# EAGLE design RN42_breakout (EAGLE 7.5.0)
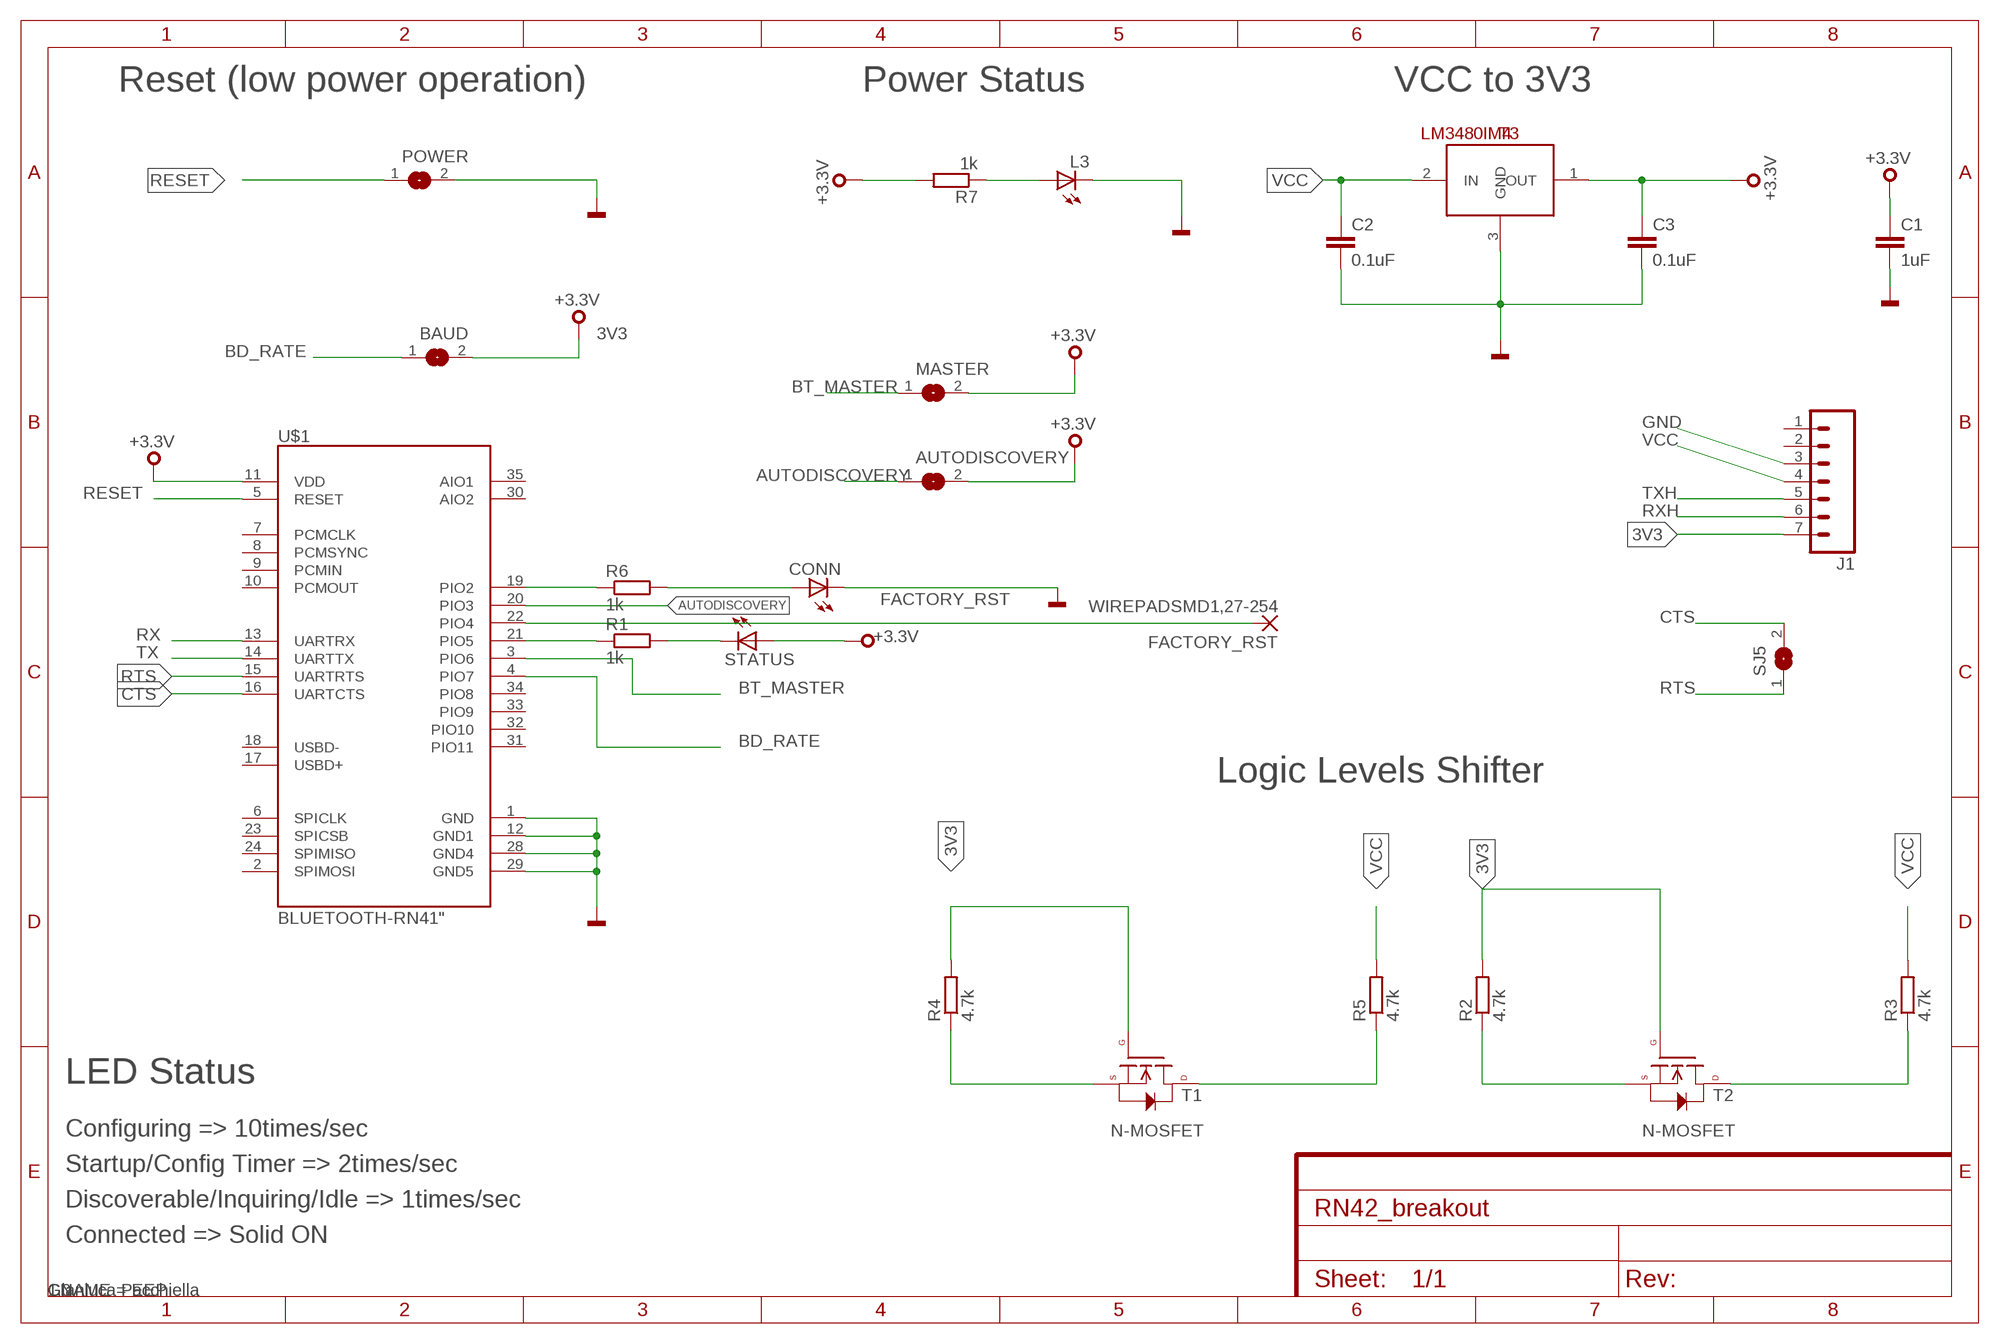
[diagram p0: schematic, sheet 1]
FRAME1 (FRAME-A4L): CNAME: EEP; CREVISION: 1.0; DESIGNER: Gianluca Pacchiella

## Parts
AUTODISCOVERY  SJ  [SJ]
BAUD  SJ  [SJ]
C1  1uF  C-EUC0603  [C0603]
C2  0.1uF  CAP0603-CAP  [0603-CAP]
C3  0.1uF  CAP0603-CAP  [0603-CAP]
CONN  LEDCHIPLED_0603  [CHIPLED_0603]
FACTORY_RST  WIREPADSMD1,27-254  [SMD1,27-2,54]
J1  M07  [1X07]
L3  LEDCHIPLED_0603  [CHIPLED_0603]
MASTER  SJ  [SJ]
POWER  SJ  [SJ]
R1  1k  R-EU_R0603  [R0603]
R2  4.7k  R-EU_R0603  [R0603]
R3  4.7k  R-EU_R0603  [R0603]
R4  4.7k  R-EU_R0603  [R0603]
R5  4.7k  R-EU_R0603  [R0603]
R6  1k  R-EU_R0603  [R0603]
R7  1k  R-EU_R0603  [R0603]
SJ5  SJ  [SJ]
STATUS  LEDCHIPLED_0603  [CHIPLED_0603]
T1  N-MOSFET  N-CHANNEL-MOSFET-BSS138  [SOT23-3]
T2  N-MOSFET  N-CHANNEL-MOSFET-BSS138  [SOT23-3]
T3  LM3480IM4  [SOT23-3]
U$1  BLUETOOTH-RN41"  [RN41]

## Nets
3V3: AUTODISCOVERY.2 BAUD.2 C1.1 C3.1 J1.7 MASTER.2 R2.2 R4.2 R7.2 STATUS.A T1.1(G) T2.1(G) T3.1(OUT) U$1.11(VDD) ; supply symbol labelled +3.3V
AUTODISCOVERY: AUTODISCOVERY.1 U$1.20(PIO3)
BD_RATE: BAUD.1 U$1.4(PIO7)
BT_MASTER: MASTER.1 U$1.3(PIO6)
CTS: SJ5.2 U$1.16(UARTCTS)
FACTORY_RST: FACTORY_RST.1(P) U$1.22(PIO4)
GND: C1.2 C2.2 C3.2 CONN.C J1.3 L3.C POWER.2 T3.3(GND) U$1.1(GND) U$1.12(GND1) U$1.28(GND4) U$1.29(GND5)
N$1: R1.2 STATUS.C
N$2: R1.1 U$1.21(PIO5)
N$3: CONN.A R6.2
N$4: L3.A R7.1
RESET: POWER.1 U$1.5(RESET)
RTS: SJ5.1 U$1.15(UARTRTS)
RX: R2.1 T2.2(S) U$1.13(UARTRX)
RXH: J1.6 R3.1 T2.3(D)
STATUS: R6.1 U$1.19(PIO2)
TX: R4.1 T1.2(S) U$1.14(UARTTX)
TXH: J1.5 R5.1 T1.3(D)
VCC: C2.1 J1.4 R3.2 R5.2 T3.2(IN)
Unconnected: J1.1 J1.2 U$1.2(SPIMOSI) U$1.6(SPICLK) U$1.7(PCMCLK) U$1.8(PCMSYNC) U$1.9(PCMIN) U$1.10(PCMOUT) U$1.17(USBD+) U$1.18(USBD-) U$1.23(SPICSB) U$1.24(SPIMISO) U$1.30(AIO2) U$1.31(PIO11) U$1.32(PIO10) U$1.33(PIO9) U$1.34(PIO8) U$1.35(AIO1)

## Notes on the sheet
- Reset (low power operation) | Power Status | VCC to 3V3
- Logic Levels Shifter
- LED Status
- Configuring => 10times/sec
- Startup/Config Timer => 2times/sec
- Discoverable/Inquiring/Idle => 1times/sec
- Connected => Solid ON

## Library data of the parts
AUTODISCOVERY BAUD MASTER POWER SJ5 = jumper:SJ: SMD solder JUMPER
C1 = rcl:C-EU: CAPACITOR, European symbol
C2 C3 = SparkFun-Passives:CAP: Capacitor Standard 0603 ceramic capacitor, and 0.1" leaded capacitor.
CONN L3 STATUS = led:LED: LED OSRAM: - CHIPLED LG R971, LG N971, LY N971, LG Q971, LY Q971, LO R971, LY R971 LH N974, LH R974 LS Q976, LO Q976, LY Q976 LO Q996 - Hyper CHIPLED LW Q18S LB Q993, LB Q99A, LB R99A - SideLED LS A670, LO A670, LY A670, LG A670, LP A670 LB A673, LV A673, LT A673, LW A673 LH A674 LY A675 LS A676, LA A676, LO A676, LY A676, LW A676 LS A679, LY A679, LG A679 - Hyper Micro SIDELED® LS Y876, LA Y876, LO Y876, LY Y876 LT Y87S - SmartLED LW L88C, LW L88S LB L89C, LB L89S, LG L890 LS L89K, LO L89K, LY L89K LS L896, LA L896, LO L896, LY L896 - TOPLED LS T670, LO T670, LY T670, LG T670, LP T670 LSG T670, LSP T670, LSY T670, LOP T670, LYG T670 LG T671, LOG T671, LSG T671 LB T673, LV T673, LT T673, LW T673 LH T674 LS T676, LA T676, LO T676, LY T676, LB T676, LH T676, LSB T676, LW T676 LB T67C, LV T67C, LT T67C, LS T67K, LO T67K, LY T67K, LW E67C LS E67B, LA E67B, LO E67B, LY E67B, LB E67C, LV E67C, LT E67C LW T67C LS T679, LY T679, LG T679 LS T770, LO T770, LY T770, LG T770, LP T770 LB T773, LV T773, LT T773, LW T773 LH T774 LS E675, LA E675, LY E675, LS T675 LS T776, LA T776, LO T776, LY T776, LB T776 LHGB T686 LT T68C, LB T68C - Hyper Mini TOPLED® LB M676 - Mini TOPLED Santana® LG M470 LS M47K, LO M47K, LY M47K Source: http://www.osram.convergy.de LUXEON: - LUMILED® LXK2-PW12-R00, LXK2-PW12-S00, LXK2-PW14-U00, LXK2-PW14-V00 LXK2-PM12-R00, LXK2-PM12-S00, LXK2-PM14-U00 LXK2-PE12-Q00, LXK2-PE12-R00, LXK2-PE12-S00, LXK2-PE14-T00, LXK2-PE14-U00 LXK2-PB12-K00, LXK2-PB12-L00, LXK2-PB12-M00, LXK2-PB14-N00, LXK2-PB14-P00, LXK2-PB14-Q00 LXK2-PR12-L00, LXK2-PR12-M00, LXK2-PR14-Q00, LXK2-PR14-R00 LXK2-PD12-Q00, LXK2-PD12-R00, LXK2-PD12-S00 LXK2-PH12-R00, LXK2-PH12-S00 LXK2-PL12-P00, LXK2-PL12-Q00, LXK2-PL12-R00 Source: www.luxeon.com KINGBRIGHT: KA-3528ASYC Source: www.kingbright.com
FACTORY_RST = wirepad:WIREPAD: Wire PAD connect wire on PCB
J1 = SparkFun-Connectors:M07: Header 7 Standard 7-pin 0.1" header. Use with straight break away headers (SKU : PRT-00116), right angle break away headers (PRT-00553), swiss pins (PRT-00743), machine pins (PRT-00117), and female headers (PRT-00115). NOTES ON THE VARIANTS LOCK and LOCK_LONGPADS... This footprint was designed to help hold the alignment of a through-hole component (i.e. 7-pin header) while soldering it into place. You may notice that each hole has been shifted either up or down by 0.005 of an inch from it's more standard position (which is usually a perfectly straight line). This slight alteration caused the pins (the squares in the middle) to touch the edges of the holes. Because they are alternating, it causes a "brace" to hold the header in place. 0.005 has proven to be the perfect amount of "off-center" position when using our standard breakaway headers. Although looks a little odd when you look at the bare footprint, once you have a header in there, the alteration is very hard to notice. Also, if you push a header all the way into place, it is covered up entirely on the bottom side. This idea of altering the position of holes to aid alignment will be further integrated into the Sparkfun Library for other footprints. It can help hold any component with 3 or more connection pins.
R1-R7 = rcl:R-EU_: RESISTOR, European symbol
T1 = GeekAmmo:N-CHANNEL-MOSFET: N-Channel MOSFET Mode Field Effect Transistor; DATASHEET: http://www.onsemi.com/pub/Collateral/NTR4501N-D.PDF; DIGIKEY: BSS138TR-ND; ELEMENT14: 2323154; URL: http://au.element14.com/fairchild-semiconductor/bss138/mosfet-n-ch-50v-220ma-sot-23/dp/2323154
T2 = GeekAmmo:N-CHANNEL-MOSFET: N-Channel MOSFET Mode Field Effect Transistor; DATASHEET: http://www.fairchildsemi.com/ds/BS/BSS138.pdf; DIGIKEY: BSS138TR-ND; ELEMENT14: 2323154; URL: http://au.element14.com/fairchild-semiconductor/bss138/mosfet-n-ch-50v-220ma-sot-23/dp/2323154
T3 = SparkFun-PowerIC:LM3480IM4: Small package linear regulator
U$1 = SparkFun:BLUETOOTH-RN41

## Board
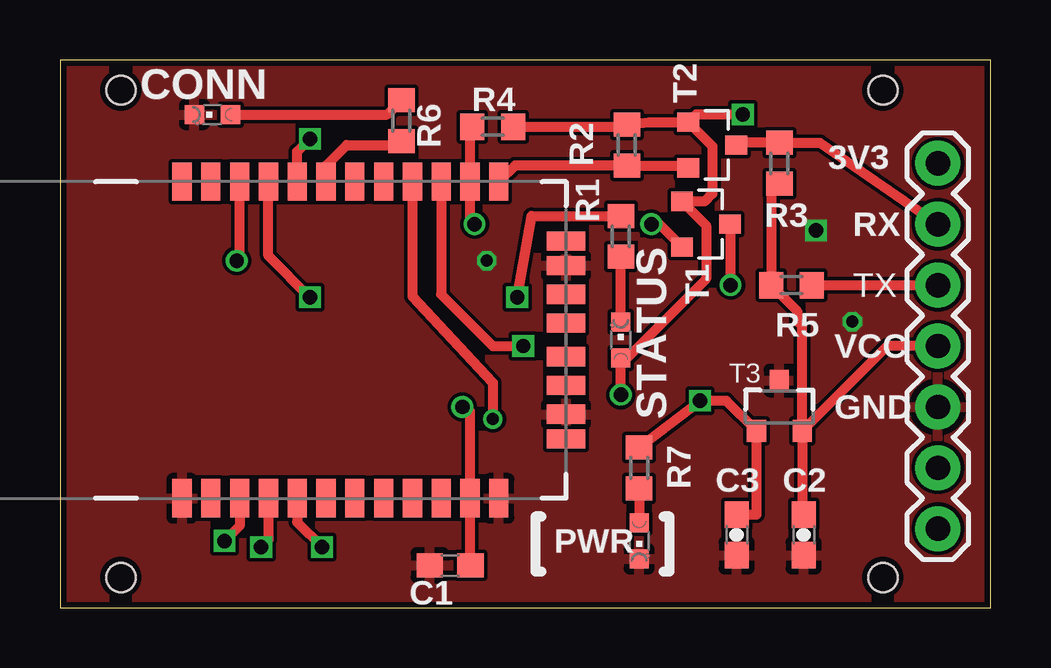
[diagram p1: board, top side]
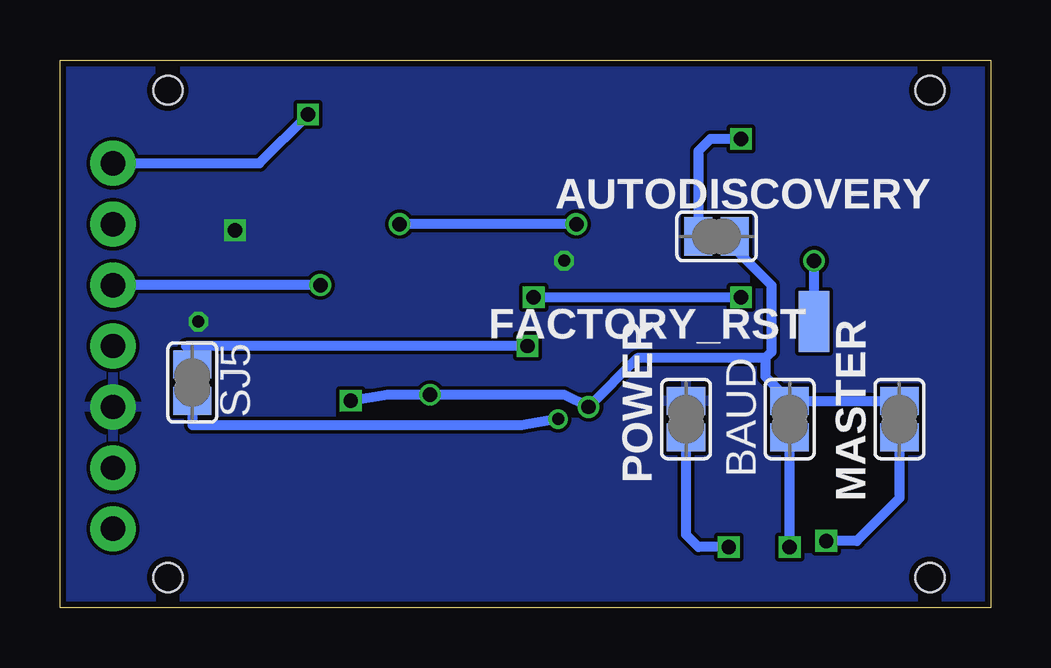
[diagram p2: board, bottom side, seen from below]

Size 38.79 x 22.85 mm. Coordinates in mm from the lower left corner, seen from the top.
Outline: 0,0 38.79,0 38.79,22.85 0,22.85 0,0
Copper layers (1*16): Top 0.035mm / dielectric 1.5mm / Bottom 0.035mm
Design rules "SeeedStudio_2layer_DRU_no_angle_20140221": minimum track width 6mil, minimum drill 12mil, track to track 6mil, track to pad 6mil, pad to pad 6mil, via to via 6mil, smd to smd 0mil, copper to edge 10mil, drill to drill 10mil, minimum pad ring 10mil, minimum via ring 6mil, stop-mask expansion 2mil, vias tented up to drill 100mil, thermal gap 10mil
Holes 1.2 mm at 2.54,21.59 2.54,1.27 34.29,21.59 34.29,1.27

### Footprints (pad centres in the part's own frame; a part is rotated, then mirrored left to right if it is on the bottom)
SJ = smd 1.168 x 1.6: 1 -0.762,0; 2 0.762,0
C0603 = smd 1.1 x 1: 1 -0.85,0; 2 0.85,0
0603-CAP = smd 1.1 x 1: 1 -0.85,0; 2 0.85,0
CHIPLED_0603 = smd 0.8 x 0.8: A 0,-0.75; C 0,0.75
SMD1,27-2,54 = smd 1.27 x 2.54: 1 0,0
1X07 = drill 1.016 pad 1.88: 1 0,0; 2 2.54,0; 3 5.08,0; 4 7.62,0; 5 10.16,0; 6 12.7,0; 7 15.24,0
R0603 = smd 1 x 1.1: 1 -0.85,0; 2 0.85,0
SOT23-3 = smd 0.8 x 0.9: 1 -0.95,-1; 2 0.95,-1; 3 0,1
SOT23-3' = smd 0.8 x 0.9: 1 -0.95,-1; 2 0.95,-1; 3 0,1.1
RN41 = smd 0.8 x 1.6: 1 -6.6,-6.6; 2 -5.4,-6.6; 3 -4.2,-6.6; 4 -3,-6.6; 5 -1.8,-6.6; 6 -0.6,-6.6; 7 0.6,-6.6; 8 1.8,-6.6; 9 3,-6.6; 10 4.2,-6.6; 11 5.4,-6.6; 12 6.6,-6.6; 13 6.6,6.6; 14 5.4,6.6; 15 4.2,6.6; 16 3,6.6; 17 1.8,6.6; 18 0.6,6.6; 19 -0.6,6.6; 20 -1.8,6.6; 21 -3,6.6; 22 -4.2,6.6; 23 -5.4,6.6; 24 -6.6,6.6 | smd 1.6 x 0.8: 28 9.4,3.1; 29 9.4,-3.1; 30 9.4,-4.122; 31 9.4,-1.9; 32 9.4,-0.7; 33 9.4,0.7; 34 9.4,1.9; 35 9.4,4.122

### Placement (x,y rotation side)
AUTODISCOVERY  11.43,15.49 0 bottom
BAUD  8.38,7.87 90 bottom
C1  16.26,1.78 180 top
C2  30.99,3.05 270 top
C3  28.19,3.05 270 top
CONN  6.35,20.57 90 top
FACTORY_RST  7.37,11.94 0 bottom
J1  36.58,3.3 90 top
L3  24.13,2.79 180 top
MASTER  3.81,7.87 90 bottom
POWER  12.7,7.87 90 bottom
R1  23.37,15.49 270 top
R2  23.62,19.3 90 top
R3  29.97,18.54 270 top
R4  18.03,20.07 0 top
R5  30.48,13.46 180 top
R6  14.22,20.32 90 top
R7  24.13,5.84 90 top
SJ5  33.27,9.4 270 bottom
STATUS  23.37,11.18 0 top
T1  26.92,16 270 top
T2  27.18,19.3 270 top
T3  LM3480IM4  [SOT23-3']  29.97,8.38 0 top
U$1  11.68,11.18 0 top

### Tracks (layer width: path | path; a pad name or v marks a point on that pad's centre or on a via)
3V3  (via drill 0.6)
  Top 0.406: v16.76,8.38 17.08,8.19 U$1.11 17.08,1.78 C1.1 | v23.37,8.89 STATUS.A 23.63,10.43 26.92,13.72 26.92,15.95 T1.1 26.86,16.95 27.18,17.27 27.18,19.25 T2.1 | 26.69,8.65 v26.67,8.64 | v26.67,8.64 27.77,8.64 T3.1 29.02,3.9 C3.1 | T2.1 24.54,20.25 R2.2 23.03,20.07 R4.2 | R7.2 v26.67,8.64 | v28.45,20.57 26.5,20.57 T2.1
  Bottom 0.406: v26.67,8.64 25.15,8.89 v23.37,8.89 17.78,8.89 v16.76,8.38 14.73,10.41 9.4,10.41 | 36.58,18.29 J1.7 30.48,18.54 v28.45,20.57 | 9.4,10.41 9.14,10.67 9.14,13.46 10.67,14.99 AUTODISCOVERY.2 | 9.4,10.41 9.4,9.65 BAUD.2 MASTER.2
AUTODISCOVERY  (via drill 0.6)
  Top 0.406: U$1.20 9.88,19.03 v10.41,19.56
  Bottom 0.406: v10.41,19.56 11.68,19.56 12.19,19.05 AUTODISCOVERY.1
BD_RATE  (via drill 0.6)
  Top 0.406: U$1.4 8.68,2.84 v8.38,2.54
  Bottom 0.406: v8.38,2.54 BAUD.1
BT_MASTER  (via drill 0.6)
  Top 0.406: U$1.3 7.48,3.42 v6.86,2.79
  Bottom 0.406: MASTER.1 3.81,4.57 5.59,2.79 v6.86,2.79
CTS  (via drill 0.5)
  Top 0.406: U$1.16 14.68,13 18.03,9.4 v18.03,7.87
  Bottom 0.406: v18.03,7.87 19.56,7.62 33.27,7.62 SJ5.2
FACTORY_RST  (via drill 0.6)
  Top 0.406: v7.37,14.48 7.48,14.6 U$1.22
  Bottom 0.406: FACTORY_RST.1 v7.37,14.48
GND  (via drill 0.5 pad 0.3, 0.6)
  other vias: 31.5,15.75 17.78,14.48 33.02,11.94
  pour Top: 0.25,24.13 40.89,24.38 40.64,-3.05 0,-3.05
  pour Bottom: 0.25,24.38 0,-3.05 40.64,-3.3 40.89,24.13
N$1
  Top 0.406: STATUS.C R1.2
N$2  (via drill 0.6)
  Top 0.406: R1.1 19.65,16.34 v19.05,12.95 | U$1.21 8.68,14.68 v10.41,12.95
  Bottom 0.406: v10.41,12.95 v19.05,12.95
N$3
  Top 0.406: CONN.A 13.63,20.57 R6.2
N$4
  Top 0.406: R7.1 L3.A
RESET  (via drill 0.6)
  Top 0.406: U$1.5 9.88,3.58 v10.92,2.54
  Bottom 0.406: v10.92,2.54 12.19,2.54 12.7,3.05 POWER.1
RTS  (via drill 0.6)
  Top 0.406: U$1.15 15.88,13.07 18.03,10.92 v19.3,10.92
  Bottom 0.406: v19.3,10.92 33.53,10.92 33.27,10.67 SJ5.1
RX
  Top 0.406: U$1.13 18.96,18.45 R2.1 26.08,18.45 T2.2
RXH
  Top 0.406: J1.6 31.66,19.39 R3.1 28.18,19.39 T2.3
STATUS
  Top 0.406: U$1.19 11.08,18.45 11.94,19.3 14.06,19.3 R6.1
TX  (via drill 0.6, 0.6 pad 0.81)
  Top 0.406: v17.27,16 17.08,16.07 U$1.14 17.08,19.97 R4.1 | v24.64,16 24.97,16 T1.2
  Bottom 0.406: v17.27,16 v24.64,16
TXH  (via drill 0.6)
  Top 0.406: T1.3 27.92,13.48 v27.94,13.46 | R5.1 J1.5
  Bottom 0.406: v27.94,13.46 J1.5
VCC
  Top 0.406: R3.2 29.63,17.69 R5.2 30.73,12.36 30.73,11.94 30.92,11.75 T3.2 | T3.2 30.92,3.96 C2.1 | J1.4 34.46,10.92 T3.2

### Text on the board
tPlace: 3V3 | RX | TX | VCC | GND
tNames: PWR